# Altium project CW308T_S6LX9.PrjPcb
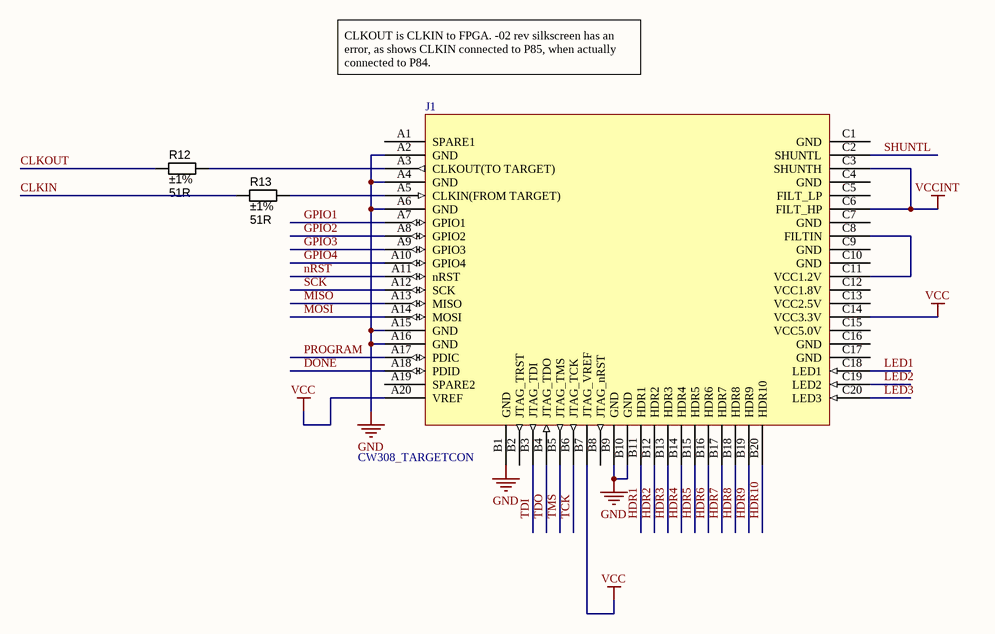
[diagram p0: CW308T_S6LX9_Connector.SchDoc]
PrjLicense: GPL; PrjName: CW308T-S6LX9; PrjRev: 02
3 sheets, 42 parts. Net scope: global (net labels, ports and power ports of the same name join across sheets).
Board files: CW308T_S6LX9.PcbDoc, CW308T_S6LX9_PANEL.PcbDoc
Sheets:
  CW308T_S6LX9_Connector.SchDoc
  CW308T_S6LX9_FPGAMisc.SchDoc
  CW308T_S6LX9_FPGAIO.SchDoc

## Sheet CW308T_S6LX9_Connector.SchDoc: CW308 Connections
size Letter; Organization: NewAE Technology Inc.; Address1: 1083 Queen St., Suite 196; Address2: Halifax; Address3: NS; Address4: Canada B3H 0B2; SheetNumber: 1; SheetTotal: 3; SheetApproved: Yes

### Parts
J1  CW308_TARGETCON  [CW308_TBOARD_CONN]
R12  value 51R  Tolerance: ±1%  [RESC1608X55N]  (hidden comment: Thick Film)
R13  value 51R  Tolerance: ±1%  [RESC1608X55N]  (hidden comment: Thick Film)

### Nets
GND: J1.A2(GND) J1.A4(GND) J1.A6(GND) J1.A15(GND) J1.A16(GND) J1.B1(GND) J1.B9(GND) J1.B10(GND)
VCC: J1.A20(VREF) J1.B7(JTAG_VREF) J1.C14(VCC3.3V)
VCCINT: J1.C3(SHUNTH) J1.C6(FILT_HP)
CLKIN: R13.1
CLKOUT: R12.1
DONE: J1.A18(PDID)
GPIO1: J1.A7(GPIO1)
GPIO2: J1.A8(GPIO2)
GPIO3: J1.A9(GPIO3)
GPIO4: J1.A10(GPIO4)
HDR1: J1.B11(HDR1)
HDR2: J1.B12(HDR2)
HDR3: J1.B13(HDR3)
HDR4: J1.B14(HDR4)
HDR5: J1.B15(HDR5)
HDR6: J1.B16(HDR6)
HDR7: J1.B17(HDR7)
HDR8: J1.B18(HDR8)
HDR9: J1.B19(HDR9)
HDR10: J1.B20(HDR10)
LED1: J1.C18(LED1)
LED2: J1.C19(LED2)
LED3: J1.C20(LED3)
MISO: J1.A13(MISO)
MOSI: J1.A14(MOSI)
nRST: J1.A11(nRST)
PROGRAM: J1.A17(PDIC)
SCK: J1.A12(SCK)
SHUNTL: J1.C2(SHUNTL)
TCK: J1.B6(JTAG_TCK)
TDI: J1.B3(JTAG_TDI)
TDO: J1.B4(JTAG_TDO)
TMS: J1.B5(JTAG_TMS)
NetJ1_A3: J1.A3(CLKOUT(TO_TARGET)) R12.2
NetJ1_A5: J1.A5(CLKIN(FROM_TARGET)) R13.2
NetJ1_C8: J1.C8(FILTIN) J1.C11(VCC1.2V)

Not connected (* = marked no-connect by the designer): J1 A1(SPARE1) A19(SPARE2) B2(JTAG_TRST) B8(JTAG_nRST) C1(GND) C4(GND) C5(FILT_LP) C7(GND) C9(GND) C10(GND) C12(VCC1.8V) C13(VCC2.5V) C15(VCC5.0V) C16(GND) C17(GND)

### Notes on the sheet
- CLKOUT is CLKIN to FPGA. -02 rev silkscreen has an error, as shows CLKIN connected to P85, when actually connected to P84.
- Title:
- Date:
- Rev:
- Time:
- Project:
- Sheet
- of
- License:
- Copyright © NewAE Technology Inc.
- Approved:
- NewAE.com
- File:

### Library data of the parts
J1 = CW308_TBOARD: CW308 "Standard" Target Board Connector
R12 R13 = RES_51R_0603_1%: Resistor SMD chip 51 Ohm 0.1W 1% 0603; Manufacturer 1: Yageo; Manufacturer Part Number 1: RC0603FR-0751RL; Ratings: 1/10 W; SCDType: spec; Package / Case: 0603 (1608 metric); Material: Thick Film; Supplier 1: Digi-Key; Supplier Part Number 1: 311-51.0HRCT-ND

## Sheet CW308T_S6LX9_FPGAMisc.SchDoc: FPGA Power Meas, Decoupling, JTAG
size Letter; Organization: NewAE Technology Inc.; Address1: 1083 Queen St., Suite 196; Address2: Halifax; Address3: NS; Address4: Canada B3H 0B2; SheetNumber: 2; SheetTotal: 3; SheetApproved: Yes
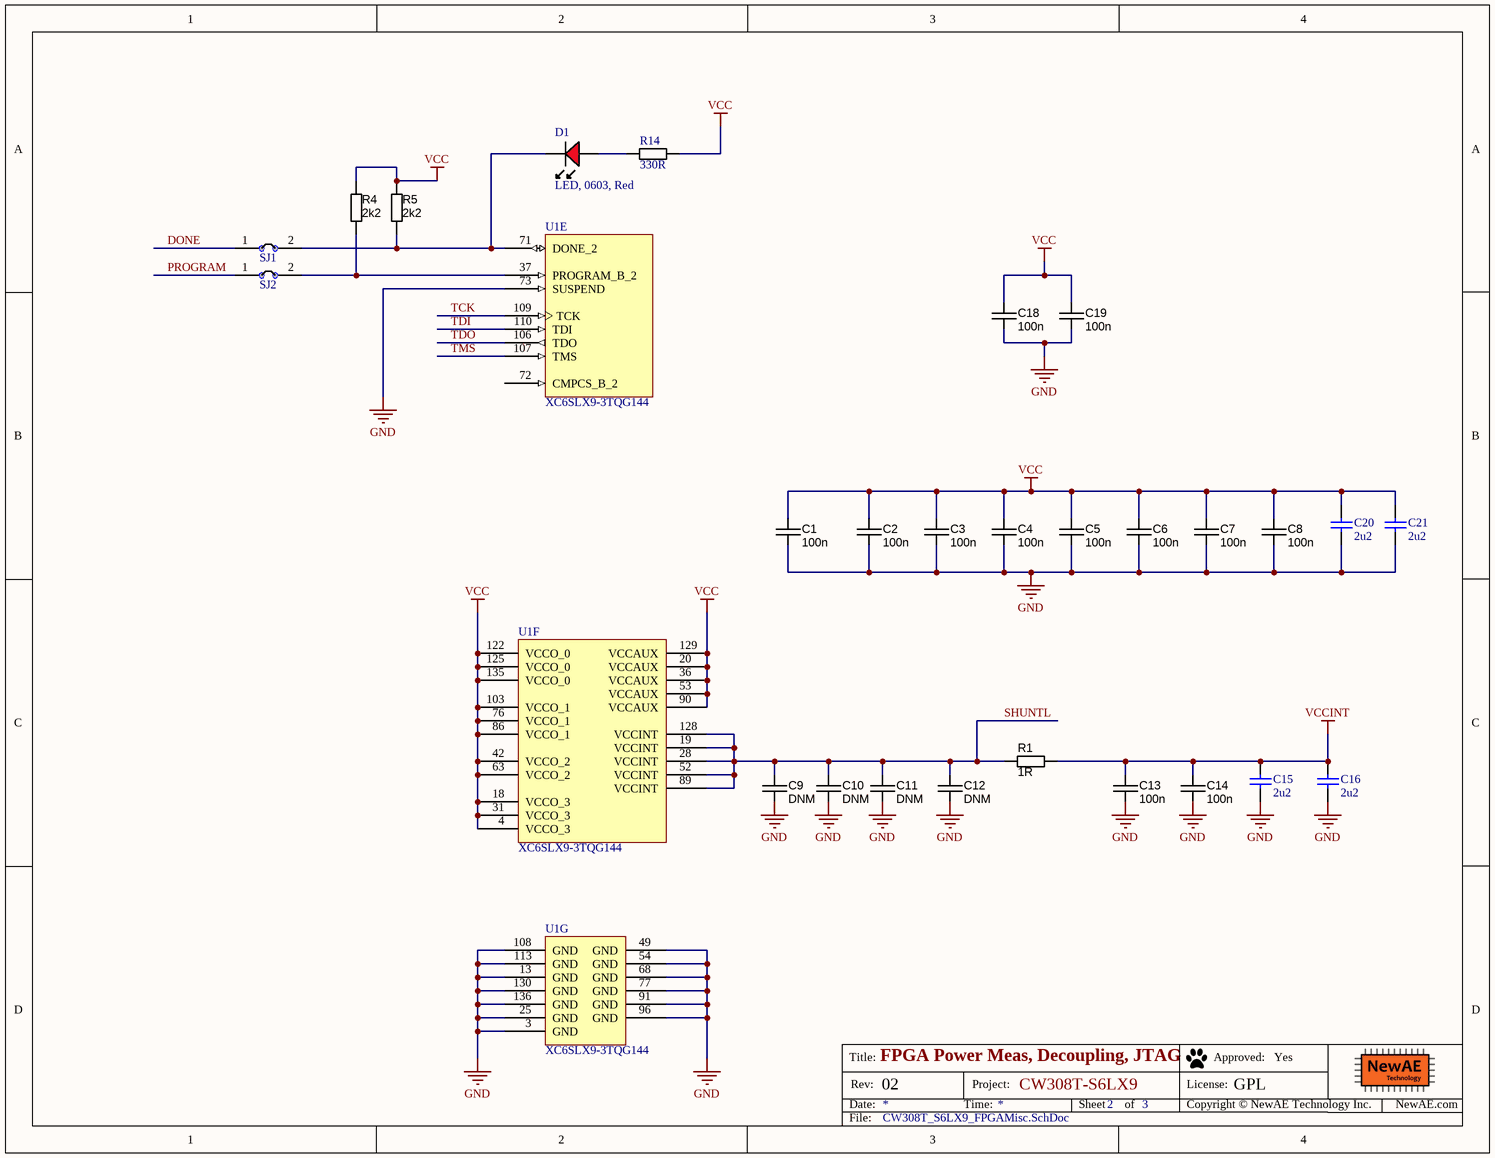
[diagram p1: CW308T_S6LX9_FPGAMisc.SchDoc]

### Parts
(Parts that share a designator on the sheet are numbered #1, #2 ... from top to bottom, then left to right.)
C1  value 100n  [CAPC1608X90N]  (hidden comment: approved sub OK)
C2  value 100n  [CAPC1608X90N]  (hidden comment: approved sub OK)
C3  value 100n  [CAPC1608X90N]  (hidden comment: approved sub OK)
C4  value 100n  [CAPC1608X90N]  (hidden comment: approved sub OK)
C5  value 100n  [CAPC1608X90N]  (hidden comment: approved sub OK)
C6  value 100n  [CAPC1608X90N]  (hidden comment: approved sub OK)
C7  value 100n  [CAPC1608X90N]  (hidden comment: approved sub OK)
C8  value 100n  [CAPC1608X90N]  (hidden comment: approved sub OK)
C9  value DNM  [CAPC1608X90N]  (hidden comment: approved sub OK)
C10  value DNM  [CAPC1608X90N]  (hidden comment: approved sub OK)
C11  value DNM  [CAPC1608X90N]  (hidden comment: approved sub OK)
C12  value DNM  [CAPC1608X90N]  (hidden comment: approved sub OK)
C13  value 100n  [CAPC1608X90N]  (hidden comment: approved sub OK)
C14  value 100n  [CAPC1608X90N]  (hidden comment: approved sub OK)
C15  2u2  [CAPC0603_M]
C16  2u2  [CAPC0603_M]
C18  value 100n  [CAPC1608X90N]  (hidden comment: approved sub OK)
C19  value 100n  [CAPC1608X90N]  (hidden comment: approved sub OK)
C20  2u2  [CAPC0603_M]
C21  2u2  [CAPC0603_M]
D1  LED, 0603, Red  [LED-0603-RED]
R1  value 1R  [RESC1608X55N]  (hidden comment: Thick Film)
R4  value 2k2  [RESC1608X55N]  (hidden comment: Thick Film)
R5  value 2k2  [RESC1608X55N]  (hidden comment: Thick Film)
R14  330R  [RESC1608X55N]
SJ1  NC  [SJ_2S_NC]  (value not drawn)  (no BOM)
SJ2  NC  [SJ_2S_NC]  (value not drawn)  (no BOM)
U1#1  XC6SLX9-3TQG144  [TQG144_L]  (parts E,F of 7)
U1#2  XC6SLX9-3TQG144  [TQG144_L]  (part G of 7)

### Nets
GND: C1.2 C2.2 C3.2 C4.2 C5.2 C6.2 C7.2 C8.2 C9.2 C10.2 C11.2 C12.2 C13.2 C14.2 C15.2 C16.2 C18.2 C19.2 C20.2 C21.2 U1#1.73(SUSPEND) U1#2.3(GND) U1#2.13(GND) U1#2.25(GND) U1#2.49(GND) U1#2.54(GND) U1#2.68(GND) U1#2.77(GND) U1#2.91(GND) U1#2.96(GND) U1#2.108(GND) U1#2.113(GND) U1#2.130(GND) U1#2.136(GND)
VCC: C1.1 C2.1 C3.1 C4.1 C5.1 C6.1 C7.1 C8.1 C18.1 C19.1 C20.1 C21.1 R4.1 R5.1 R14.2 U1#1.4(VCCO_3) U1#1.18(VCCO_3) U1#1.20(VCCAUX) U1#1.31(VCCO_3) U1#1.36(VCCAUX) U1#1.42(VCCO_2) U1#1.53(VCCAUX) U1#1.63(VCCO_2) U1#1.76(VCCO_1) U1#1.86(VCCO_1) U1#1.90(VCCAUX) U1#1.103(VCCO_1) U1#1.122(VCCO_0) U1#1.125(VCCO_0) U1#1.129(VCCAUX) U1#1.135(VCCO_0)
VCCINT: C13.1 C14.1 C15.1 C16.1 R1.2
DONE: SJ1.1
PROGRAM: SJ2.1
SHUNTL: C9.1 C10.1 C11.1 C12.1 R1.1 U1#1.19(VCCINT) U1#1.28(VCCINT) U1#1.52(VCCINT) U1#1.89(VCCINT) U1#1.128(VCCINT)
TCK: U1#1.109(TCK)
TDI: U1#1.110(TDI)
TDO: U1#1.106(TDO)
TMS: U1#1.107(TMS)
NetD1_A: D1.A R14.1
NetD1_K: D1.K R5.2 SJ1.2 U1#1.71(DONE_2)
NetR4_2: R4.2 SJ2.2 U1#1.37(PROGRAM_B_2)

Not connected (* = marked no-connect by the designer): U1#1 72(CMPCS_B_2)

### Notes on the sheet
- Title:
- Date:
- Rev:
- Time:
- Project:
- Sheet
- of
- License:
- Copyright © NewAE Technology Inc.
- Approved:
- NewAE.com
- File:

### Library data of the parts
C1-C14 C18 C19 = CAPC_100n_0603_X7R_50V_10%: Capacitor SMD Cer 100nF 10% 50V X7R 0603; Manufacturer 1: AVX Corporation; Manufacturer Part Number 1: 06035C104KAT2A; Ratings: 50V; X7R; Material: ceramic; SCDType: spec; Manufacturer 2: TDK Corporation; Manufacturer Part Number 2: C1608X7R1H104K; Package / Case: 0603 (1608 Metric); Tolerance: ±10%; Supplier 1: Digi-Key; Supplier Part Number 1: 478-5052-1-ND; ComponentLink1URL: http://www.avx.com/docs/Catalogs/cx7r.pdf; ComponentLink1Description: http://www.avx.com/docs/Catalogs/cx7r.pdf; Supplier 2: Digi-Key; Supplier Part Number 2: 445-1314-1-ND; ComponentLink2URL: http://product.tdk.com/capacitor/mlcc/en/documents/mlcc_commercial_general_en.pdf; ComponentLink2Description: http://product.tdk.com/capacitor/mlcc/en/documents/mlcc_commercial_general_en.pdf
C15 C16 C20 C21 = CCHIP-2u2-0603: 2u2, 0603; Component Group: Capacitor; Case-EIA: 0603; Case-Metric: 1608; Part Number: CCHIP-2u2-0603; Footprint: 0603; Pin Count: 2; Value: 2u2; Mounting Technology: SMT; Component Kind: Standard; Component Type: Standard
D1 = LEDCHIP_0603_RED: Chip LED, Red; Component Group: Optical; Part Number: LEDCHIP_0603_RED; Pin Count: 2; Mounting Technology: SMT; Component Kind: Standard; Component Type: Standard
R1 = RES_3R3_0603_5%: Resistor SMD chip 1 Ohm 0.1W 5% 0603; Manufacturer 1: Yageo; Manufacturer Part Number 1: RC0603JR-073R3L; Ratings: 1/10 W; SCDType: spec; Package / Case: 0603 (1608 metric); Tolerance: ±5%; ComponentLink1URL: http://www.yageo.com/documents/recent/PYu-RC0603_51_RoHS_L_4.pdf; ComponentLink1Description: http://www.yageo.com/documents/recent/PYu-RC0603_51_RoHS_L_4.pdf; Supplier 1: Digi-Key; Supplier Part Number 1: 311-3.3GRCT-ND
R4 R5 = RES_1K_0603_5%: Resistor SMD chip 1k Ohm 0.1W 5% 0603; Manufacturer 1: Yageo; Manufacturer Part Number 1: RC0603JR-071KL; Ratings: 1/10 W; SCDType: spec; Package / Case: 0603 (1608 metric); Tolerance: ±5%; Material: Thick Film; Supplier 1: Digi-Key; Supplier Part Number 1: 311-1.0KGRCT-ND; Supplier 2: Digi-Key; Supplier Part Number 2: 541-1.0KGCT-ND; Manufacturer 2: Vishay Dale; Manufacturer Part Number 2: CRCW06031K00JNEA; ComponentLink2URL: http://www.vishay.com/doc?20008; ComponentLink2Description: http://www.vishay.com/doc?20008; ComponentLink1URL: http://www.yageo.com/documents/recent/PYu-RC0603_51_RoHS_L_4.pdf; ComponentLink1Description: http://www.yageo.com/documents/recent/PYu-RC0603_51_RoHS_L_4.pdf
R14 = RCHIP-330R-0603: 330R res, 0603, 1%, 1/10W; Manufacture 1: Yageo; Manufacture Part Number 1: RC0603FR-07330RL; Component Group: Resistor; Case-EIA: 0603; Case-Metric: 1608; Rated Power: 0.1W; Rated Voltage: 75VDC; Part Number: RCHIP-330R-0603; Footprint: 0603; Pin Count: 2; Supplier 1: Digi-Key; Supplier Part Number 1: 311-330HRCT-ND; Value: 330R; Tolerance: 1%; Mounting Technology: SMT; Temperature Range: -55C to 155C; Component Kind: Standard; Component Type: Standard
SJ1 SJ2 = SJ_2S: Solder Jumper, NC
U1#1 U1#2 = CMP-0068-00084-1: Spartan-6 LX 1.0V FPGA, 102 User I/Os, 144-Pin TQFP (0.5mm Pitch), Low Power Version, Commercial Grade, Pb-Free; PackageDescription: 144-Pin Thin Quad Flat Pack (TQG144) - Pb-Free; DatasheetVersion: ver1.6, Nov-2010; PackageReference: TQG144; PackageVersion: ver1.2, Jun-2004; Code_JEDEC: MS-026-BFB; PartId: 1

## Sheet CW308T_S6LX9_FPGAIO.SchDoc: FPGA I/O Pins, Configuration
size Letter; Organization: NewAE Technology Inc.; Address1: 1083 Queen St., Suite 196; Address2: Halifax; Address3: NS; Address4: Canada B3H 0B2; SheetNumber: 3; SheetTotal: 3; SheetApproved: Yes
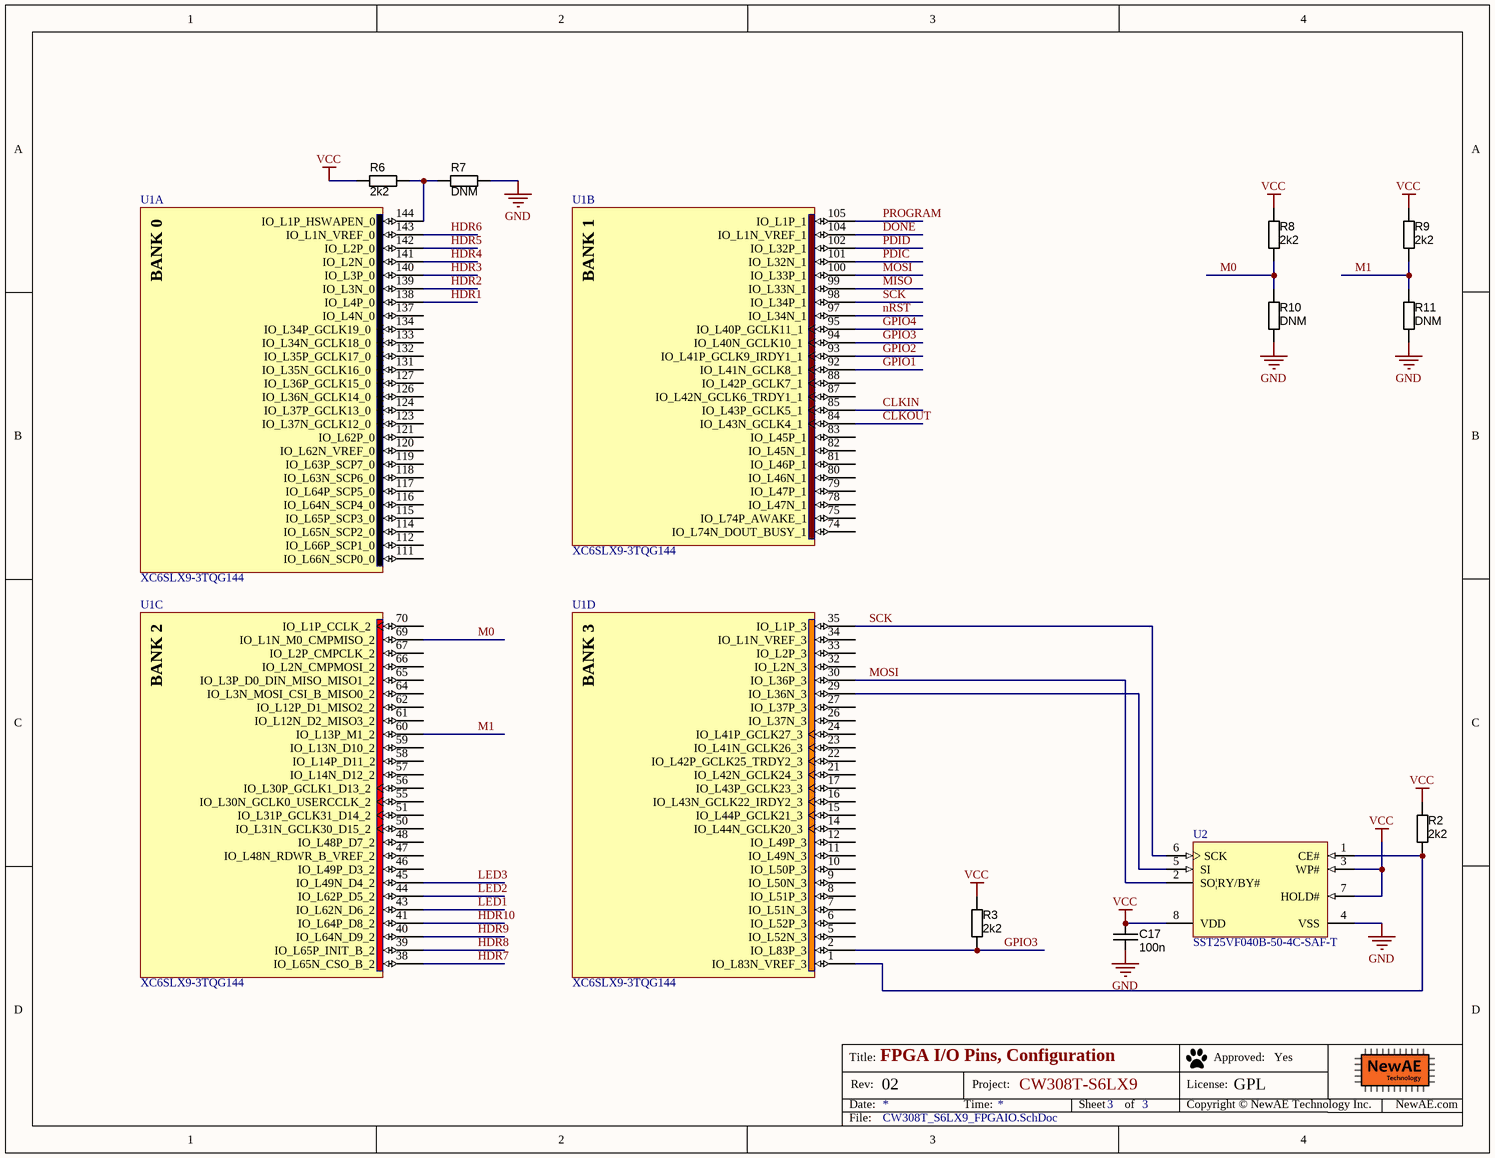
[diagram p2: CW308T_S6LX9_FPGAIO.SchDoc]

### Parts
(Parts that share a designator on the sheet are numbered #1, #2 ... from top to bottom, then left to right.)
C17  value 100n  [CAPC1608X90N]  (hidden comment: approved sub OK)
R2  value 2k2  [RESC1608X55N]  (hidden comment: Thick Film)
R3  value 2k2  [RESC1608X55N]  (hidden comment: Thick Film)
R6  value 2k2  [RESC1608X55N]  (hidden comment: Thick Film)
R7  value DNM  [RESC1608X55N]  (hidden comment: Thick Film)
R8  value 2k2  [RESC1608X55N]  (hidden comment: Thick Film)
R9  value 2k2  [RESC1608X55N]  (hidden comment: Thick Film)
R10  value DNM  [RESC1608X55N]  (hidden comment: Thick Film)
R11  value DNM  [RESC1608X55N]  (hidden comment: Thick Film)
U1#1  XC6SLX9-3TQG144  [TQG144_L]  (part B of 7)
U1#2  XC6SLX9-3TQG144  [TQG144_L]  (parts A,C,D of 7)
U2  SST25VF040B-50-4C-SAF-T  [MCHP-SOIC-SA8_N]

### Nets
GND: C17.2 R7.2 R10.1 R11.1 U2.4(VSS)
VCC: C17.1 R2.1 R3.1 R6.1 R8.2 R9.2 U2.3(WP#) U2.7(HOLD#) U2.8(VDD)
CLKIN: U1#1.85(IO_L43P_GCLK5_1)
CLKOUT: U1#1.84(IO_L43N_GCLK4_1)
DONE: U1#1.104(IO_L1N_VREF_1)
GPIO1: U1#1.92(IO_L41N_GCLK8_1)
GPIO2: U1#1.93(IO_L41P_GCLK9_IRDY1_1)
GPIO3: R3.2 U1#1.94(IO_L40N_GCLK10_1) U1#2.2(IO_L83P_3)
GPIO4: U1#1.95(IO_L40P_GCLK11_1)
HDR1: U1#2.138(IO_L4P_0)
HDR2: U1#2.139(IO_L3N_0)
HDR3: U1#2.140(IO_L3P_0)
HDR4: U1#2.141(IO_L2N_0)
HDR5: U1#2.142(IO_L2P_0)
HDR6: U1#2.143(IO_L1N_VREF_0)
HDR7: U1#2.38(IO_L65N_CSO_B_2)
HDR8: U1#2.39(IO_L65P_INIT_B_2)
HDR9: U1#2.40(IO_L64N_D9_2)
HDR10: U1#2.41(IO_L64P_D8_2)
LED1: U1#2.43(IO_L62N_D6_2)
LED2: U1#2.44(IO_L62P_D5_2)
LED3: U1#2.45(IO_L49N_D4_2)
M0: R8.1 R10.2 U1#2.69(IO_L1N_M0_CMPMISO_2)
M1: R9.1 R11.2 U1#2.60(IO_L13P_M1_2)
MISO: U1#1.99(IO_L33N_1)
MOSI: U1#1.100(IO_L33P_1) U1#2.30(IO_L36P_3) U2.2(SO|RY/BY#)
nRST: U1#1.97(IO_L34N_1)
PDIC: U1#1.101(IO_L32N_1)
PDID: U1#1.102(IO_L32P_1)
PROGRAM: U1#1.105(IO_L1P_1)
SCK: U1#1.98(IO_L34P_1) U1#2.35(IO_L1P_3) U2.6(SCK)
NetR2_2: R2.2 U1#2.1(IO_L83N_VREF_3) U2.1(CE#)
NetR6_2: R6.2 R7.1 U1#2.144(IO_L1P_HSWAPEN_0)
NetU1#2_29: U1#2.29(IO_L36N_3) U2.5(SI)

Not connected (* = marked no-connect by the designer): U1#1 74(IO_L74N_DOUT_BUSY_1) 75(IO_L74P_AWAKE_1) 78(IO_L47N_1) 79(IO_L47P_1) 80(IO_L46N_1) 81(IO_L46P_1) 82(IO_L45N_1) 83(IO_L45P_1) 87(IO_L42N_GCLK6_TRDY1_1) 88(IO_L42P_GCLK7_1); U1#2 5(IO_L52N_3) 6(IO_L52P_3) 7(IO_L51N_3) 8(IO_L51P_3) 9(IO_L50N_3) 10(IO_L50P_3) 11(IO_L49N_3) 12(IO_L49P_3) 14(IO_L44N_GCLK20_3) 15(IO_L44P_GCLK21_3) 16(IO_L43N_GCLK22_IRDY2_3) 17(IO_L43P_GCLK23_3) 21(IO_L42N_GCLK24_3) 22(IO_L42P_GCLK25_TRDY2_3) 23(IO_L41N_GCLK26_3) 24(IO_L41P_GCLK27_3) 26(IO_L37N_3) 27(IO_L37P_3) 32(IO_L2N_3) 33(IO_L2P_3) 34(IO_L1N_VREF_3) 46(IO_L49P_D3_2) 47(IO_L48N_RDWR_B_VREF_2) 48(IO_L48P_D7_2) 50(IO_L31N_GCLK30_D15_2) 51(IO_L31P_GCLK31_D14_2) 55(IO_L30N_GCLK0_USERCCLK_2) 56(IO_L30P_GCLK1_D13_2) 57(IO_L14N_D12_2) 58(IO_L14P_D11_2) 59(IO_L13N_D10_2) 61(IO_L12N_D2_MISO3_2) 62(IO_L12P_D1_MISO2_2) 64(IO_L3N_MOSI_CSI_B_MISO0_2) 65(IO_L3P_D0_DIN_MISO_MISO1_2) 66(IO_L2N_CMPMOSI_2) 67(IO_L2P_CMPCLK_2) 70(IO_L1P_CCLK_2) 111(IO_L66N_SCP0_0) 112(IO_L66P_SCP1_0) 114(IO_L65N_SCP2_0) 115(IO_L65P_SCP3_0) 116(IO_L64N_SCP4_0) 117(IO_L64P_SCP5_0) 118(IO_L63N_SCP6_0) 119(IO_L63P_SCP7_0) 120(IO_L62N_VREF_0) 121(IO_L62P_0) 123(IO_L37N_GCLK12_0) 124(IO_L37P_GCLK13_0) 126(IO_L36N_GCLK14_0) 127(IO_L36P_GCLK15_0) 131(IO_L35N_GCLK16_0) 132(IO_L35P_GCLK17_0) 133(IO_L34N_GCLK18_0) 134(IO_L34P_GCLK19_0) 137(IO_L4N_0)

### Notes on the sheet
- Title:
- Date:
- Rev:
- Time:
- Project:
- Sheet
- of
- License:
- Copyright © NewAE Technology Inc.
- Approved:
- NewAE.com
- File:
- (in symbol CMP-0068-00084-1, part A) BANK 0
- (in symbol CMP-0068-00084-1, part B) BANK 1
- (in symbol CMP-0068-00084-1, part C) BANK 2
- (in symbol CMP-0068-00084-1, part D) BANK 3

### Library data of the parts
C17 = CAPC_100n_0603_X7R_50V_10%: as C1 on sheet CW308T_S6LX9_FPGAMisc; Manufacturer 2: TDK Corporation; Manufacturer Part Number 2: C1608X7R1H104K; Package / Case: 0603 (1608 Metric); Tolerance: ±10%; Supplier 1: Digi-Key; Supplier Part Number 1: 478-5052-1-ND; ComponentLink1URL: http://www.avx.com/docs/Catalogs/cx7r.pdf; ComponentLink1Description: http://www.avx.com/docs/Catalogs/cx7r.pdf; Supplier 2: Digi-Key; Supplier Part Number 2: 445-1314-1-ND; ComponentLink2URL: http://product.tdk.com/capacitor/mlcc/en/documents/mlcc_commercial_general_en.pdf; ComponentLink2Description: http://product.tdk.com/capacitor/mlcc/en/documents/mlcc_commercial_general_en.pdf
R2 R3 R6-R11 = RES_1K_0603_5%: as R4 on sheet CW308T_S6LX9_FPGAMisc; Package / Case: 0603 (1608 metric); Tolerance: ±5%; Material: Thick Film; Supplier 1: Digi-Key; Supplier Part Number 1: 311-1.0KGRCT-ND; Supplier 2: Digi-Key; Supplier Part Number 2: 541-1.0KGCT-ND; Manufacturer 2: Vishay Dale; Manufacturer Part Number 2: CRCW06031K00JNEA; ComponentLink2URL: http://www.vishay.com/doc?20008; ComponentLink2Description: http://www.vishay.com/doc?20008; ComponentLink1URL: http://www.yageo.com/documents/recent/PYu-RC0603_51_RoHS_L_4.pdf; ComponentLink1Description: http://www.yageo.com/documents/recent/PYu-RC0603_51_RoHS_L_4.pdf
U1#1 U1#2 = CMP-0068-00084-1: as U1#1 on sheet CW308T_S6LX9_FPGAMisc; PackageDescription: 144-Pin Thin Quad Flat Pack (TQG144) - Pb-Free; DatasheetVersion: ver1.6, Nov-2010; PackageReference: TQG144; PackageVersion: ver1.2, Jun-2004; Code_JEDEC: MS-026-BFB; PartId: 1
U2 = CMP-0378-00095-1: 4 Mbit SPI Serial Flash, 2.7 to 3.6 V, 50 MHz, 0 to 70 degC, 8-pin SOIC (SA8), Tape and Reel; Manufacturer: Microchip; DatasheetVersion: Rev. A; ComponentLink1Description: Manufacturer URL; ComponentLink3URL: http://ww1.microchip.com/downloads/en/DeviceDoc/25080A.pdf; ComponentLink2URL: http://ww1.microchip.com/downloads/en/DeviceDoc/25051A.pdf; PackageReference: SOIC-SA8; PackageVersion: Rev. A; ComponentLink1URL: http://www.microchip.com; PartNumber: SST25VF040B-50-4C-SAF-T; PackageDescription: 8-Lead Plastic Small Outline, 4.9 x 3.9 mm Body, 1.27 mm Pitch; ComponentLink2Description: Datasheet; Mounting Technology: Surface Mount; ComponentLink4Description: Product URL; ComponentLink3Description: Package Specification; Code_JEDEC: MS-012; ComponentLink4URL: http://www.microchip.com/SST25VF040B

## Nets that join several sheets
GND: CW308T_S6LX9_Connector (8 pins), CW308T_S6LX9_FPGAMisc (34 pins), CW308T_S6LX9_FPGAIO (5 pins)
VCC: CW308T_S6LX9_Connector (J1.A20 J1.B7 J1.C14), CW308T_S6LX9_FPGAMisc (31 pins), CW308T_S6LX9_FPGAIO (9 pins)
VCCINT: CW308T_S6LX9_Connector (J1.C3 J1.C6), CW308T_S6LX9_FPGAMisc (5 pins)
CLKIN: CW308T_S6LX9_Connector (R13.1), CW308T_S6LX9_FPGAIO (U1#1.85)
CLKOUT: CW308T_S6LX9_Connector (R12.1), CW308T_S6LX9_FPGAIO (U1#1.84)
DONE: CW308T_S6LX9_Connector (J1.A18), CW308T_S6LX9_FPGAMisc (SJ1.1), CW308T_S6LX9_FPGAIO (U1#1.104)
GPIO1: CW308T_S6LX9_Connector (J1.A7), CW308T_S6LX9_FPGAIO (U1#1.92)
GPIO2: CW308T_S6LX9_Connector (J1.A8), CW308T_S6LX9_FPGAIO (U1#1.93)
GPIO3: CW308T_S6LX9_Connector (J1.A9), CW308T_S6LX9_FPGAIO (R3.2 U1#1.94 U1#2.2)
GPIO4: CW308T_S6LX9_Connector (J1.A10), CW308T_S6LX9_FPGAIO (U1#1.95)
HDR1: CW308T_S6LX9_Connector (J1.B11), CW308T_S6LX9_FPGAIO (U1#2.138)
HDR2: CW308T_S6LX9_Connector (J1.B12), CW308T_S6LX9_FPGAIO (U1#2.139)
HDR3: CW308T_S6LX9_Connector (J1.B13), CW308T_S6LX9_FPGAIO (U1#2.140)
HDR4: CW308T_S6LX9_Connector (J1.B14), CW308T_S6LX9_FPGAIO (U1#2.141)
HDR5: CW308T_S6LX9_Connector (J1.B15), CW308T_S6LX9_FPGAIO (U1#2.142)
HDR6: CW308T_S6LX9_Connector (J1.B16), CW308T_S6LX9_FPGAIO (U1#2.143)
HDR7: CW308T_S6LX9_Connector (J1.B17), CW308T_S6LX9_FPGAIO (U1#2.38)
HDR8: CW308T_S6LX9_Connector (J1.B18), CW308T_S6LX9_FPGAIO (U1#2.39)
HDR9: CW308T_S6LX9_Connector (J1.B19), CW308T_S6LX9_FPGAIO (U1#2.40)
HDR10: CW308T_S6LX9_Connector (J1.B20), CW308T_S6LX9_FPGAIO (U1#2.41)
LED1: CW308T_S6LX9_Connector (J1.C18), CW308T_S6LX9_FPGAIO (U1#2.43)
LED2: CW308T_S6LX9_Connector (J1.C19), CW308T_S6LX9_FPGAIO (U1#2.44)
LED3: CW308T_S6LX9_Connector (J1.C20), CW308T_S6LX9_FPGAIO (U1#2.45)
MISO: CW308T_S6LX9_Connector (J1.A13), CW308T_S6LX9_FPGAIO (U1#1.99)
MOSI: CW308T_S6LX9_Connector (J1.A14), CW308T_S6LX9_FPGAIO (U1#1.100 U1#2.30 U2.2)
nRST: CW308T_S6LX9_Connector (J1.A11), CW308T_S6LX9_FPGAIO (U1#1.97)
PROGRAM: CW308T_S6LX9_Connector (J1.A17), CW308T_S6LX9_FPGAMisc (SJ2.1), CW308T_S6LX9_FPGAIO (U1#1.105)
SCK: CW308T_S6LX9_Connector (J1.A12), CW308T_S6LX9_FPGAIO (U1#1.98 U1#2.35 U2.6)
SHUNTL: CW308T_S6LX9_Connector (J1.C2), CW308T_S6LX9_FPGAMisc (10 pins)
TCK: CW308T_S6LX9_Connector (J1.B6), CW308T_S6LX9_FPGAMisc (U1#1.109)
TDI: CW308T_S6LX9_Connector (J1.B3), CW308T_S6LX9_FPGAMisc (U1#1.110)
TDO: CW308T_S6LX9_Connector (J1.B4), CW308T_S6LX9_FPGAMisc (U1#1.106)
TMS: CW308T_S6LX9_Connector (J1.B5), CW308T_S6LX9_FPGAMisc (U1#1.107)

## Assembly variants
Normal Build: not fitted C9 C10 C11 C12 R7 R10 R11